# Altium schematic sheet cSLIM-SA_RS232.SchDoc: cSLIM v1 - RS232
size A4; SheetNumber: 5; SheetTotal: 12
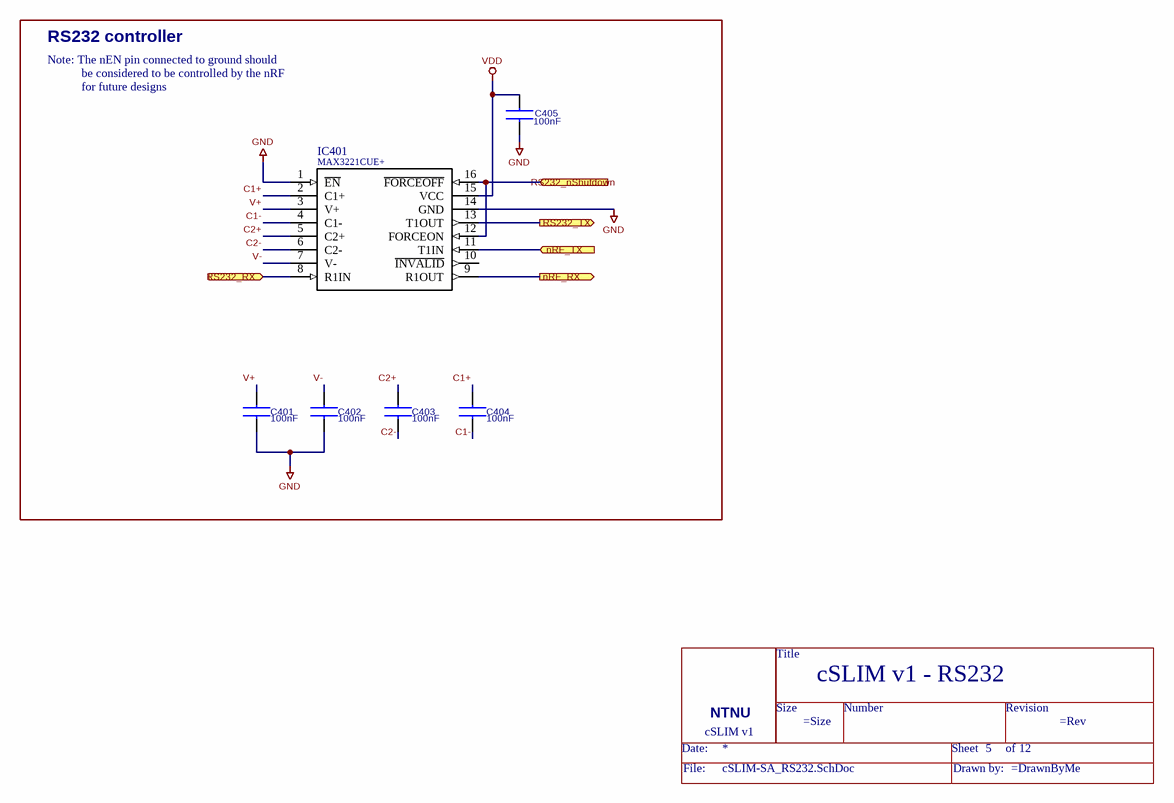
[diagram p0: cSLIM-SA_RS232.SchDoc]

## Parts
=DocumentName  Title_block  (value not drawn)  (no BOM)
C401  100nF  [CAPC1608X90N]
C402  100nF  [CAPC1608X90N]
C403  100nF  [CAPC1608X90N]
C404  100nF  [CAPC1608X90N]
C405  100nF  [CAPC1608X90N]
IC401  MAX3221CUE+  [SOP65P640X110-16N]

## Blocks framed on the sheet
RS232 controller: C401-C405 IC401

## Ports
nRF_RX (out), nRF_TX (in), RS232_nShutdown (in), RS232_RX (in), RS232_TX (out)

## Nets
GND: C401.2 C402.2 C405.2 IC401.1(~{EN}) IC401.14(GND)
VDD: C405.1 IC401.15(VCC)
C1+: C404.1 IC401.2(C1+)
C1-: C404.2 IC401.4(C1-)
C2+: C403.1 IC401.5(C2+)
C2-: C403.2 IC401.6(C2-)
nRF_RX: IC401.9(R1OUT) ; port nRF_RX
nRF_TX: IC401.11(T1IN) ; port nRF_TX
RS232_nShutdown: IC401.12(FORCEON) IC401.16(~{FORCEOFF}) ; port RS232_nShutdown
RS232_RX: IC401.8(R1IN) ; port RS232_RX
RS232_TX: IC401.13(T1OUT) ; port RS232_TX
V+: C401.1 IC401.3(V+)
V-: C402.1 IC401.7(V-)

Not connected (* = marked no-connect by the designer): IC401 10(~{INVALID})

## Notes on the sheet
- Note: The nEN pin connected to ground should
- be considered to be controlled by the nRF
- for future designs
- 1
- 2
- 3
- 4
- 5
- 6
- A
- B
- C
- Eivind Jølsgard
- D
- Title: cSLIM RS232
- File: cSLIM_RS232.sch
- Sheet: /
- NTNU
- KiCad E.D.A.  kicad (5.1.4)-1
- Size: A4
- Date: 2021-03-31
- Rev: v1
- Id: 4/11
- (in symbol Title_block) Title; Size; Number; Revision; NTNU; cSLIM v1; Date:; Sheet; of; File:; Drawn by:

## Library data of the parts
C401-C405 = C: Capacitor; Manufacturer_Part_Number: CL10B104KB8NNNL; Fitted: Yes; value: 100nF
IC401 = MAX3221CUE+: 1/1 Transceiver Full RS232 16-TSSOP; Manufacturer_Name: Maxim Integrated; Fitted: Yes; Datasheet Link: http://datasheets.maximintegrated.com/en/ds/MAX3221-MAX3243.pdf; Height: 1.1mm; Manufacturer_Part_Number: MAX3221CUE+; Mouser Part Number: 700-MAX3221CUE; Mouser Price/Stock: https://www.mouser.co.uk/ProductDetail/Maxim-Integrated/MAX3221CUE%2b?qs=1THa7WoU59EZwCeWs5OtSQ%3D%3D